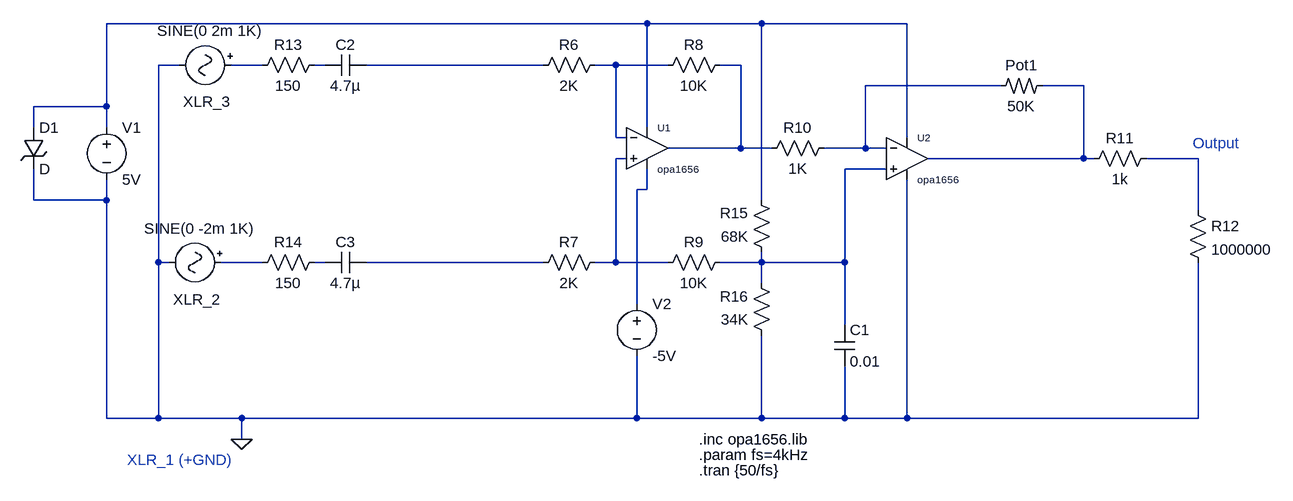
[diagram p0: schematic PreAmp.asc]
PreAmp.asc, the LTspice schematic file:
Version 4.1
SHEET 1 2164 4756
WIRE 512 -1920 -320 -1920
WIRE 688 -1920 512 -1920
WIRE 912 -1920 688 -1920
WIRE -208 -1856 -240 -1856
WIRE -80 -1856 -128 -1856
WIRE 16 -1856 0 -1856
WIRE 352 -1856 80 -1856
WIRE 464 -1856 432 -1856
WIRE 544 -1856 464 -1856
WIRE 656 -1856 624 -1856
WIRE 1056 -1824 848 -1824
WIRE 1184 -1824 1120 -1824
WIRE -320 -1792 -320 -1920
WIRE -320 -1792 -432 -1792
WIRE -432 -1760 -432 -1792
WIRE -320 -1760 -320 -1792
WIRE 512 -1760 512 -1920
WIRE 464 -1744 464 -1856
WIRE 480 -1744 464 -1744
WIRE 912 -1744 912 -1920
WIRE 656 -1728 656 -1856
WIRE 656 -1728 544 -1728
WIRE 704 -1728 656 -1728
WIRE 848 -1728 848 -1824
WIRE 848 -1728 784 -1728
WIRE 880 -1728 848 -1728
WIRE 480 -1712 464 -1712
WIRE 1184 -1712 1184 -1824
WIRE 1184 -1712 944 -1712
WIRE 1200 -1712 1184 -1712
WIRE 1360 -1712 1280 -1712
WIRE 880 -1696 816 -1696
WIRE 512 -1664 512 -1696
WIRE 512 -1664 496 -1664
WIRE -432 -1648 -432 -1696
WIRE -320 -1648 -320 -1680
WIRE -320 -1648 -432 -1648
WIRE 688 -1648 688 -1920
WIRE 1360 -1632 1360 -1712
WIRE -240 -1552 -240 -1856
WIRE -224 -1552 -240 -1552
WIRE -80 -1552 -144 -1552
WIRE 16 -1552 0 -1552
WIRE 352 -1552 80 -1552
WIRE 464 -1552 464 -1712
WIRE 464 -1552 432 -1552
WIRE 544 -1552 464 -1552
WIRE 688 -1552 688 -1568
WIRE 688 -1552 624 -1552
WIRE 816 -1552 816 -1696
WIRE 816 -1552 688 -1552
WIRE 688 -1520 688 -1552
WIRE 496 -1488 496 -1664
WIRE 816 -1456 816 -1552
WIRE -320 -1312 -320 -1648
WIRE -240 -1312 -240 -1552
WIRE -240 -1312 -320 -1312
WIRE -112 -1312 -240 -1312
WIRE 496 -1312 496 -1408
WIRE 496 -1312 -112 -1312
WIRE 688 -1312 688 -1440
WIRE 688 -1312 496 -1312
WIRE 816 -1312 816 -1392
WIRE 816 -1312 688 -1312
WIRE 912 -1312 912 -1680
WIRE 912 -1312 816 -1312
WIRE 1360 -1312 1360 -1552
WIRE 1360 -1312 912 -1312
WIRE -112 -1280 -112 -1312
FLAG -112 -1280 0
SYMBOL OpAmps\\opamp2 512 -1792 R0
WINDOW 0 16 32 Left 1
WINDOW 3 16 96 Left 1
SYMATTR InstName U1
SYMATTR Value opa1656
SYMBOL OpAmps\\opamp2 912 -1776 R0
WINDOW 0 16 32 Left 1
WINDOW 3 16 96 Left 1
SYMATTR InstName U2
SYMATTR Value opa1656
SYMBOL Misc\\signal -112 -1856 R90
WINDOW 0 41 53 VTop 2
WINDOW 3 -37 49 VBottom 2
WINDOW 123 0 0 Left 0
WINDOW 39 0 0 Left 0
SYMATTR InstName XLR_3
SYMATTR Value SINE(0 2m 1K)
SYMBOL voltage -320 -1776 R0
WINDOW 123 0 0 Left 0
WINDOW 39 0 0 Left 0
SYMATTR InstName V1
SYMATTR Value 5V
SYMBOL cap 80 -1568 R90
WINDOW 0 0 32 VBottom 2
WINDOW 3 32 32 VTop 2
SYMATTR InstName C3
SYMATTR Value 4.7µ
SYMBOL cap 80 -1872 R90
WINDOW 0 0 32 VBottom 2
WINDOW 3 32 32 VTop 2
SYMATTR InstName C2
SYMATTR Value 4.7µ
SYMBOL res 448 -1872 R90
WINDOW 0 0 56 VBottom 2
WINDOW 3 32 56 VTop 2
SYMATTR InstName R6
SYMATTR Value 2K
SYMBOL res 448 -1568 R90
WINDOW 0 0 56 VBottom 2
WINDOW 3 32 56 VTop 2
SYMATTR InstName R7
SYMATTR Value 2K
SYMBOL res 640 -1872 R90
WINDOW 0 0 56 VBottom 2
WINDOW 3 32 56 VTop 2
SYMATTR InstName R8
SYMATTR Value 10K
SYMBOL res 640 -1568 R90
WINDOW 0 0 56 VBottom 2
WINDOW 3 32 56 VTop 2
SYMATTR InstName R9
SYMATTR Value 10K
SYMBOL res 800 -1744 R90
WINDOW 0 0 56 VBottom 2
WINDOW 3 32 56 VTop 2
SYMATTR InstName R10
SYMATTR Value 1K
SYMBOL res2 1120 -1840 R90
WINDOW 0 0 32 VBottom 2
WINDOW 3 32 32 VTop 2
SYMATTR InstName Pot1
SYMATTR Value 50K
SYMBOL res 1296 -1728 R90
WINDOW 0 0 56 VBottom 2
WINDOW 3 32 56 VTop 2
SYMATTR InstName R11
SYMATTR Value 1k
SYMBOL res 16 -1872 R90
WINDOW 0 0 56 VBottom 2
WINDOW 3 32 56 VTop 2
SYMATTR InstName R13
SYMATTR Value 150
SYMBOL res 16 -1568 R90
WINDOW 0 0 56 VBottom 2
WINDOW 3 32 56 VTop 2
SYMATTR InstName R14
SYMATTR Value 150
SYMBOL res 1344 -1648 R0
SYMATTR InstName R12
SYMATTR Value 1000000
SYMBOL res 704 -1552 R180
WINDOW 0 36 76 Left 2
WINDOW 3 36 40 Left 2
SYMATTR InstName R15
SYMATTR Value 68K
SYMBOL res 704 -1424 R180
WINDOW 0 36 76 Left 2
WINDOW 3 36 40 Left 2
SYMATTR InstName R16
SYMATTR Value 34K
SYMBOL cap 800 -1456 R0
SYMATTR InstName C1
SYMATTR Value 0.01
SYMBOL Misc\\signal -128 -1552 R90
WINDOW 0 41 53 VTop 2
WINDOW 3 -37 49 VBottom 2
WINDOW 123 0 0 Left 0
WINDOW 39 0 0 Left 0
SYMATTR InstName XLR_2
SYMATTR Value SINE(0 -2m 1K)
SYMBOL TVSdiode -448 -1760 R0
SYMATTR InstName D1
SYMBOL voltage 496 -1504 R0
SYMATTR InstName V2
SYMATTR Value -5V
TEXT 592 -1232 Left 2 !.tran {50/fs}
TEXT 592 -1280 Left 2 !.inc opa1656.lib
TEXT 592 -1256 Left 2 !.param fs=4kHz
TEXT -288 -1248 Left 2 ;XLR_1 (+GND)
TEXT 1352 -1736 Left 2 ;Output

The netlist it stands for:
* PreAmp.asc
X§U1 N009 N005 N001 N012 N006 opa1656  ; pins In+ In- V+ V- OUT
X§U2 N011 N007 N001 0 N008 opa1656  ; pins In+ In- V+ V- OUT
V§XLR_3 N002 0 SINE(0 2m 1K)
V1 N001 0 5V
C3 N015 N014 4.7µ
C2 N004 N003 4.7µ
R6 N005 N004 2K
R7 N009 N015 2K
R8 N006 N005 10K
R9 N011 N009 10K
R10 N007 N006 1K
R§Pot1 N008 N007 50K
R11 N010 N008 1k
R13 N003 N002 150
R14 N014 N013 150
R12 N010 0 1000000
R15 N011 N001 68K
R16 0 N011 34K
C1 N011 0 0.01
V§XLR_2 N013 0 SINE(0 -2m 1K)
D1 N001 0 D
V2 N012 0 -5V
.model D D
.lib standard.dio
.tran {50/fs}
.inc opa1656.lib
.param fs=4kHz
* XLR_1 (+GND)
* Output
.backanno
.end